# Altium schematic sheet MotorControl.SchDoc
size A3; SheetNumber: 4; SheetTotal: 6
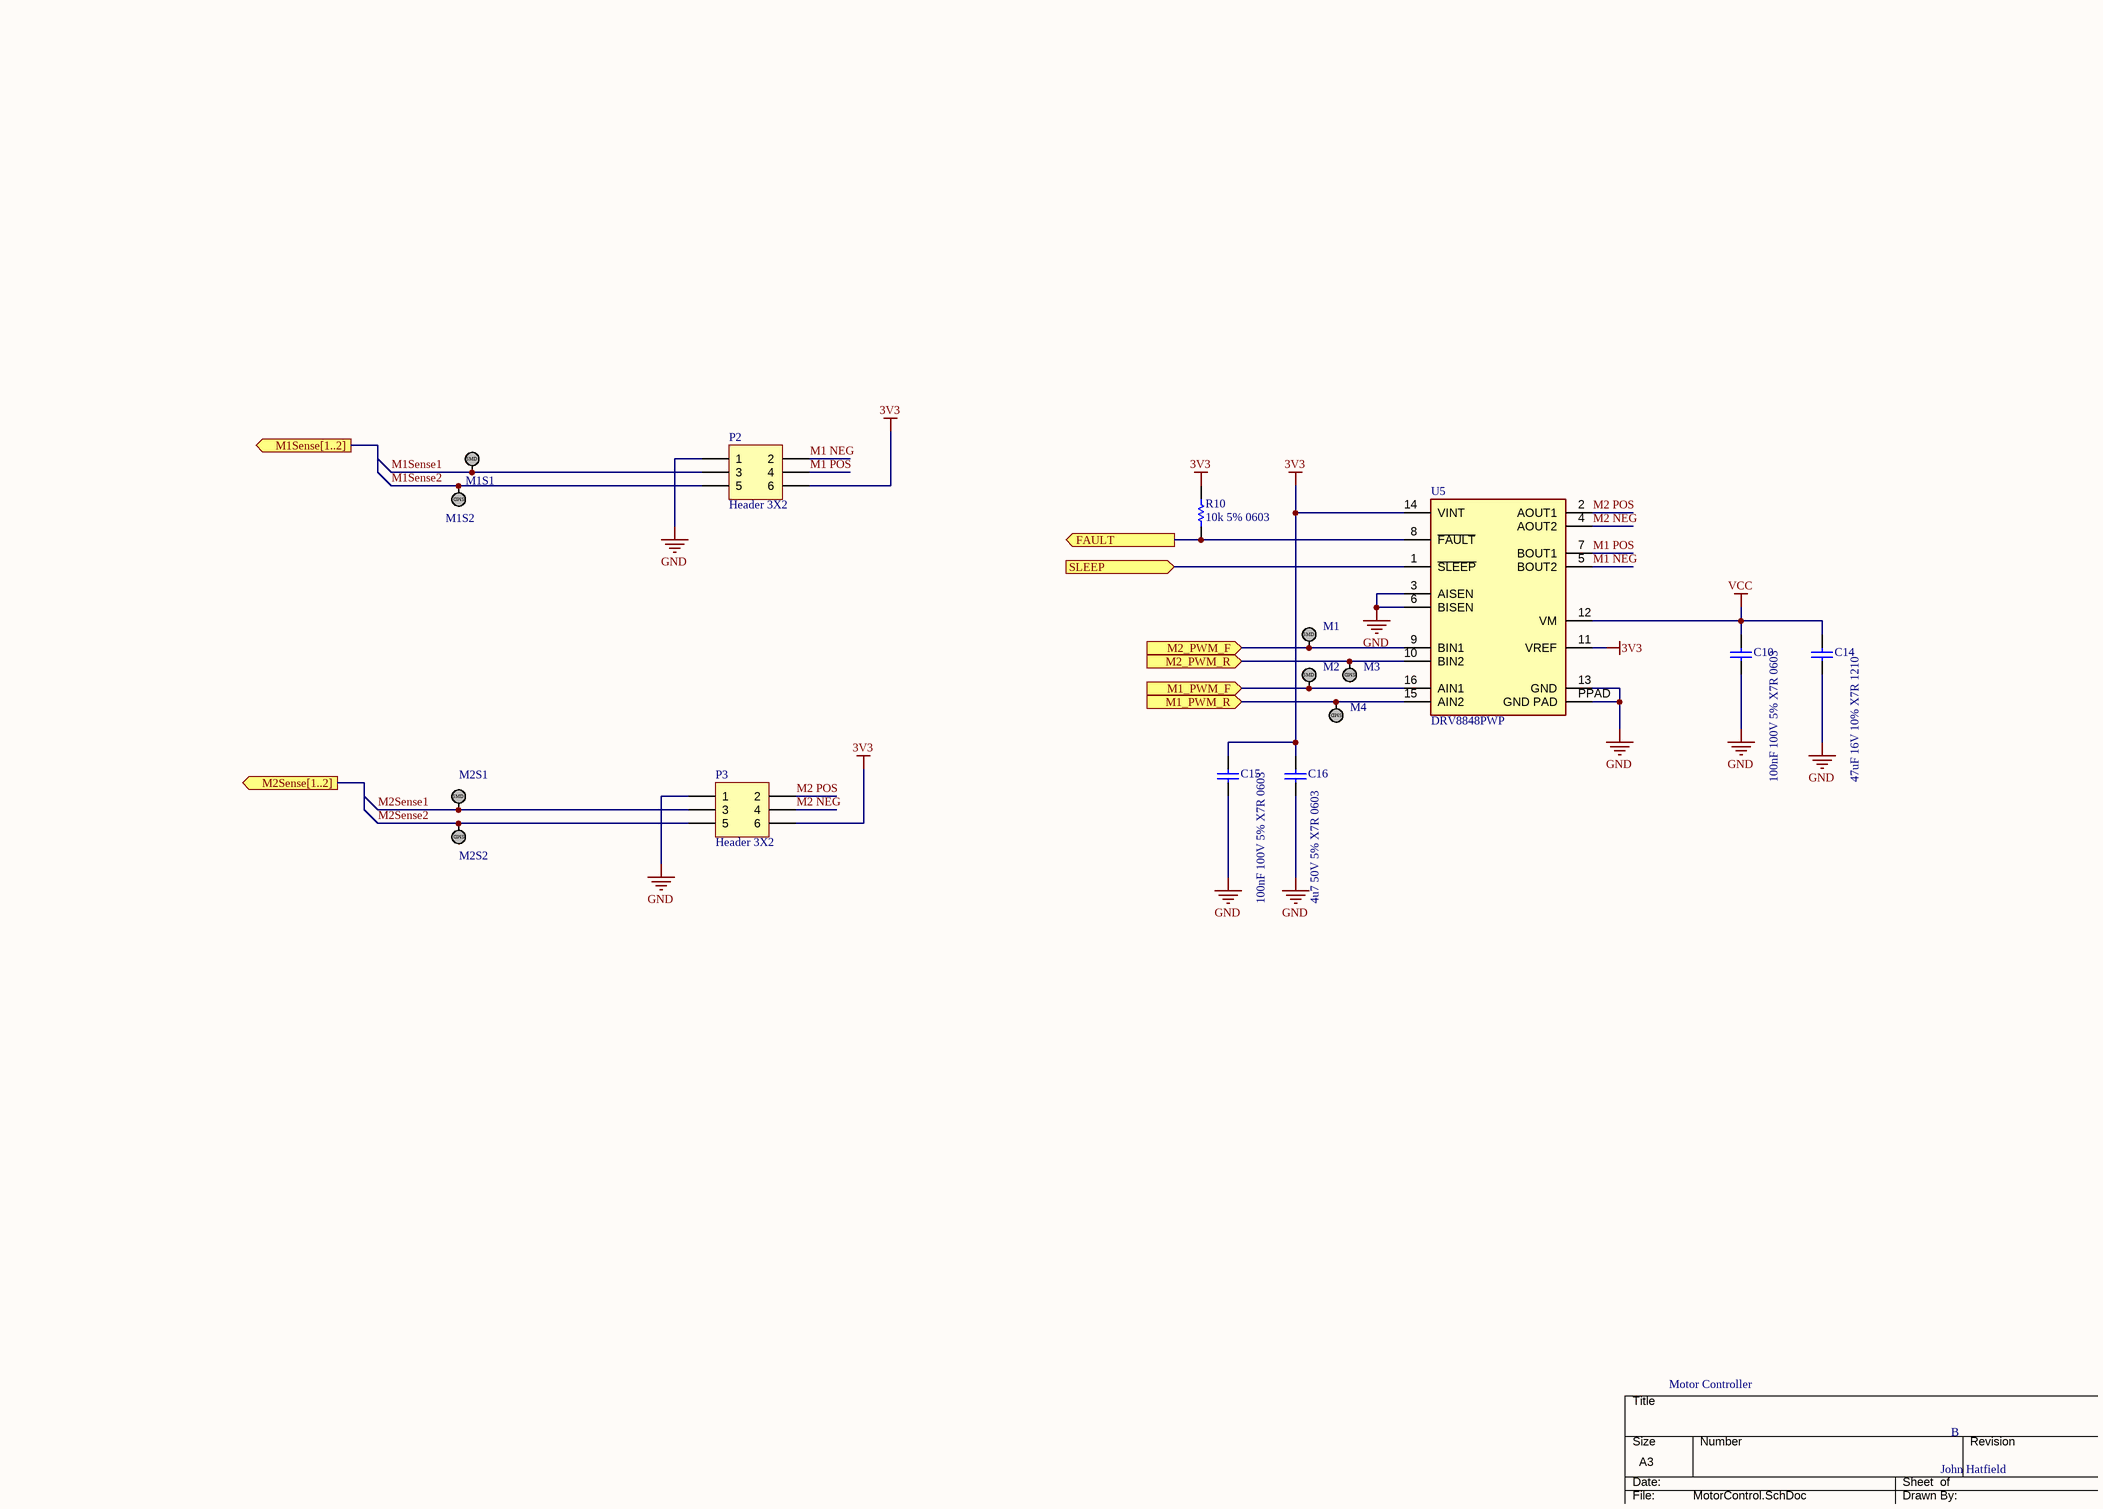
[diagram p0: MotorControl.SchDoc]

## Parts
C10  100nF 100V 5% X7R 0603  [Cap_Ceramic_0603]
C14  47uF 16V 10% X7R 1210  [Cap_Ceramic_1210]
C15  100nF 100V 5% X7R 0603  [Cap_Ceramic_0603]
C16  4u7 50V 5% X7R 0603  [Cap_Ceramic_0603]
M1  TestPoint_SMD  [TestPointSMD]  (value not drawn)
M1S1  TestPoint_SMD  [TestPointSMD]  (value not drawn)
M1S2  TestPoint_SMD  [TestPointSMD]  (value not drawn)
M2  TestPoint_SMD  [TestPointSMD]  (value not drawn)
M2S1  TestPoint_SMD  [TestPointSMD]  (value not drawn)
M2S2  TestPoint_SMD  [TestPointSMD]  (value not drawn)
M3  TestPoint_SMD  [TestPointSMD]  (value not drawn)
M4  TestPoint_SMD  [TestPointSMD]  (value not drawn)
P2  Header 3X2  [HDR2X3]
P3  Header 3X2  [HDR2X3]
R10  10k 5% 0603  [Res_ThinFilm_0603]
U5  Part Number: DRV8848PWP  [Texas_Instruments_PWP_R-PDSO-G16_0]  (hidden comment: IC_Texas_Instruments_DRV8848PWP_eec)

## Ports
FAULT (out), M1_PWM_F (in), M1_PWM_R (in), M1Sense[1..2] (out), M2_PWM_F (in), M2_PWM_R (in), M2Sense[1..2] (out), SLEEP (in)

## Nets
3V3: C15.2 C16.2 P2.6 P3.6 R10.2 U5.11(VREF) U5.14(VINT)
GND: C10.1 C14.1 C15.1 C16.1 P2.1 P3.1 U5.3(AISEN) U5.6(BISEN) U5.13(GND) U5.PPAD(GND_PAD)
VCC: C10.2 C14.2 U5.12(VM)
FAULT: R10.1 U5.8(~{FAULT}) ; port FAULT
M1 NEG: P2.2 U5.5(BOUT2)
M1 POS: P2.4 U5.7(BOUT1)
M1_PWM_F: M2.1 U5.16(AIN1) ; port M1_PWM_F
M1_PWM_R: M4.1 U5.15(AIN2) ; port M1_PWM_R
M1Sense1: M1S1.1 P2.3
M1Sense2: M1S2.1 P2.5
M2 NEG: P3.4 U5.4(AOUT2)
M2 POS: P3.2 U5.2(AOUT1)
M2_PWM_F: M1.1 U5.9(BIN1) ; port M2_PWM_F
M2_PWM_R: M3.1 U5.10(BIN2) ; port M2_PWM_R
M2Sense1: M2S1.1 P3.3
M2Sense2: M2S2.1 P3.5
SLEEP: U5.1(~{SLEEP}) ; port SLEEP

## Notes on the sheet
- Motor Controller
- B
- John Hatfield
- THIS DOCUMENT AND THE DATA DISCLOSED HEREIN OR
- HEREWITH IS THE PROPERTY OF ALTIUM LIMITED AND MAY
- DWG NO:
- REVISION
- REV:
- DESCRIPTION
- DATE
- APPROVED
- BE FREELY DISTRIBUTED IN WHOLE. NO RIGHTS ARE
- RESERVED OR EXPRESS OR IMPLIED WARANTEE GIVEN.
- ENG:
- APPROVALS
- PROJECT
- DSN:
- CHK:
- REFERENCE DOCUMENTS
- PROJECT REVISION:
- TITLE
- DOCUMENT REVISION:
- DESIGN ITEM:
- BOM:
- FAB DWG:
- PCB DWG:
- ASSY DWG:
- SCALE:
- A3
- SIZE
- CAGE CODE
- FILE NAME
- DWG NO.
- SHEET
- OF
- REV
- (in symbol TestPoint_SMD) SMD

## Library data of the parts
C10 C15 = 100nF 100V 5% X7R 0603: Capacitor, Ceramic, SMD, 100nF, 100V, 5%, X7R, 0603
C14 = 47uF 16V 10% X7R 1210: Capacitor, Ceramic, SMD, 47uF, 16V, 5%, X7R, 1210
C16 = 4u7 50V 5% X7R 0603: Capacitor, Ceramic, SMD, 4u7, 50V, 5%, X7R, 0603
P2 P3 = Header 3X2: Header, 3-Pin, Dual row; LatestRevisionDate: 17-Jul-2002; LatestRevisionNote: Re-released for DXP Platform.; Publisher: Altium Limited
R10 = 10k 5% 0603: Resistor, SMD, 10k, 0.1W, 5%, 0603
U5 = IC_Texas_Instruments_DRV8848PWP_eec: IC MOTOR DRIVER PAR 16HTSSOP; Manufacturer: Texas Instruments; Voltage: 18V; Mfg Package Ident: PWP (R-PDSO-G16); helpURL: https://upverter.com/upn/revision/bddc272fce7c23e8/; ComponentLink2Description: Datasheet; Temperature: -40°C to +85°C; Package: PWP (R-PDSO-G16); Supplier 2: Mouser; Price: 1.93395746176; Supplier 1: Digi-Key; ComponentLink1URL: https://upverter.com/upn/revision/bddc272fce7c23e8/; Supplier Part Number 2: 595-DRV8848PWP; Supplier Part Number 1: 296-38514-5-ND; ComponentLink1Description: Upverter; ComponentLink2URL: http://www.ti.com/lit/ds/symlink/drv8848.pdf; RoHS: TRUE; Mouser Part Number: 595-DRV8848PWP; Temperature Range High: +85°C; Digikey Description: IC MOTOR DRIVER PAR 16HTSSOP; Digikey Part Number: 296-38514-5-ND; Lead Free: yes; Temperature Range Low: -40°C